# Altium schematic sheet Kocka_BDD.SchDoc
size A
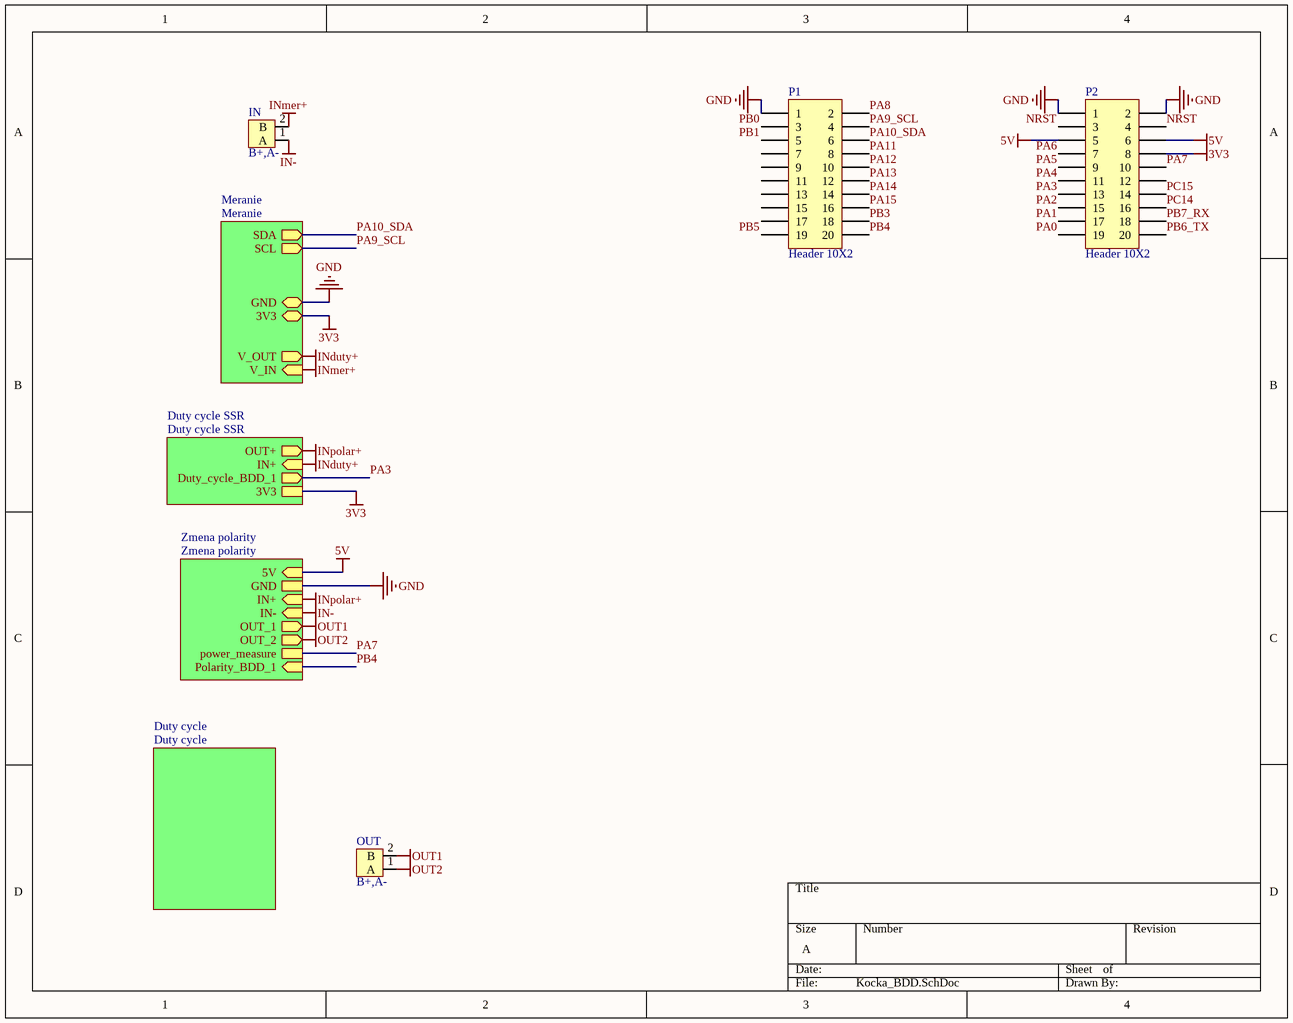
[diagram p0: Kocka_BDD.SchDoc]

## Parts
IN  B+,A-  [CON_2CH_PLUG]
OUT  B+,A-  [CON_2CH_PLUG]
P1  Header 10X2  [HDR2X10]
P2  Header 10X2  [HDR2X10]

## Sub-sheets
Duty cycle = Duty cycle: no entries
Duty cycle SSR = Duty cycle SSR: OUT+ (out), IN+ (in), Duty_cycle_BDD_1 (out), 3V3
Meranie = Meranie: SDA (out), SCL (out), GND (bidir), 3V3 (bidir), V_OUT (out), V_IN (in)
Zmena polarity = Zmena polarity: Polarity_BDD_1 (in), IN+ (in), 5V (in), IN- (in), GND, OUT_1 (out), power_measure, OUT_2 (out)

## Nets
3V3: P2.8 ; sheet Duty cycle SSR/3V3, sheet Meranie/3V3
5V: P2.5 P2.6 ; sheet Zmena polarity/5V
GND: P1.1 P2.1 P2.2 ; sheet Zmena polarity/GND, sheet Meranie/GND
IN-: IN.1(A) ; sheet Zmena polarity/IN-
INduty+: sheet Duty cycle SSR/IN+, sheet Meranie/V_OUT
INmer+: IN.2(B) ; sheet Meranie/V_IN
INpolar+: sheet Zmena polarity/IN+, sheet Duty cycle SSR/OUT+
OUT1: OUT.2(B) ; sheet Zmena polarity/OUT_1
OUT2: OUT.1(A) ; sheet Zmena polarity/OUT_2
NRST: P2.3 P2.4
PA0: P2.19
PA1: P2.17
PA2: P2.15
PA3: P2.13 ; sheet Duty cycle SSR/Duty_cycle_BDD_1
PA4: P2.11
PA5: P2.9
PA6: P2.7
PA7: P2.10 ; sheet Zmena polarity/power_measure
PA8: P1.2
PA9_SCL: P1.4 ; sheet Meranie/SCL
PA10_SDA: P1.6 ; sheet Meranie/SDA
PA11: P1.8
PA12: P1.10
PA13: P1.12
PA14: P1.14
PA15: P1.16
PB0: P1.3
PB1: P1.5
PB3: P1.18
PB4: P1.20 ; sheet Zmena polarity/Polarity_BDD_1
PB5: P1.19
PB6_TX: P2.20
PB7_RX: P2.18
PC14: P2.16
PC15: P2.14

Not connected (* = marked no-connect by the designer): P1 7 9 11 13 15 17; P2 12

## Library data of the parts
IN OUT = CON_2CH_PLUG: TBG-5.0-KW-2P
P1 P2 = Header 10X2: Header, 10-Pin, Dual row; LatestRevisionDate: 17-Jul-2002; LatestRevisionNote: Re-released for DXP Platform.; Publisher: Altium Limited